# EAGLE design esp32-poe-thermocouple-hat-prod-onboard (EAGLE 7.7.0)
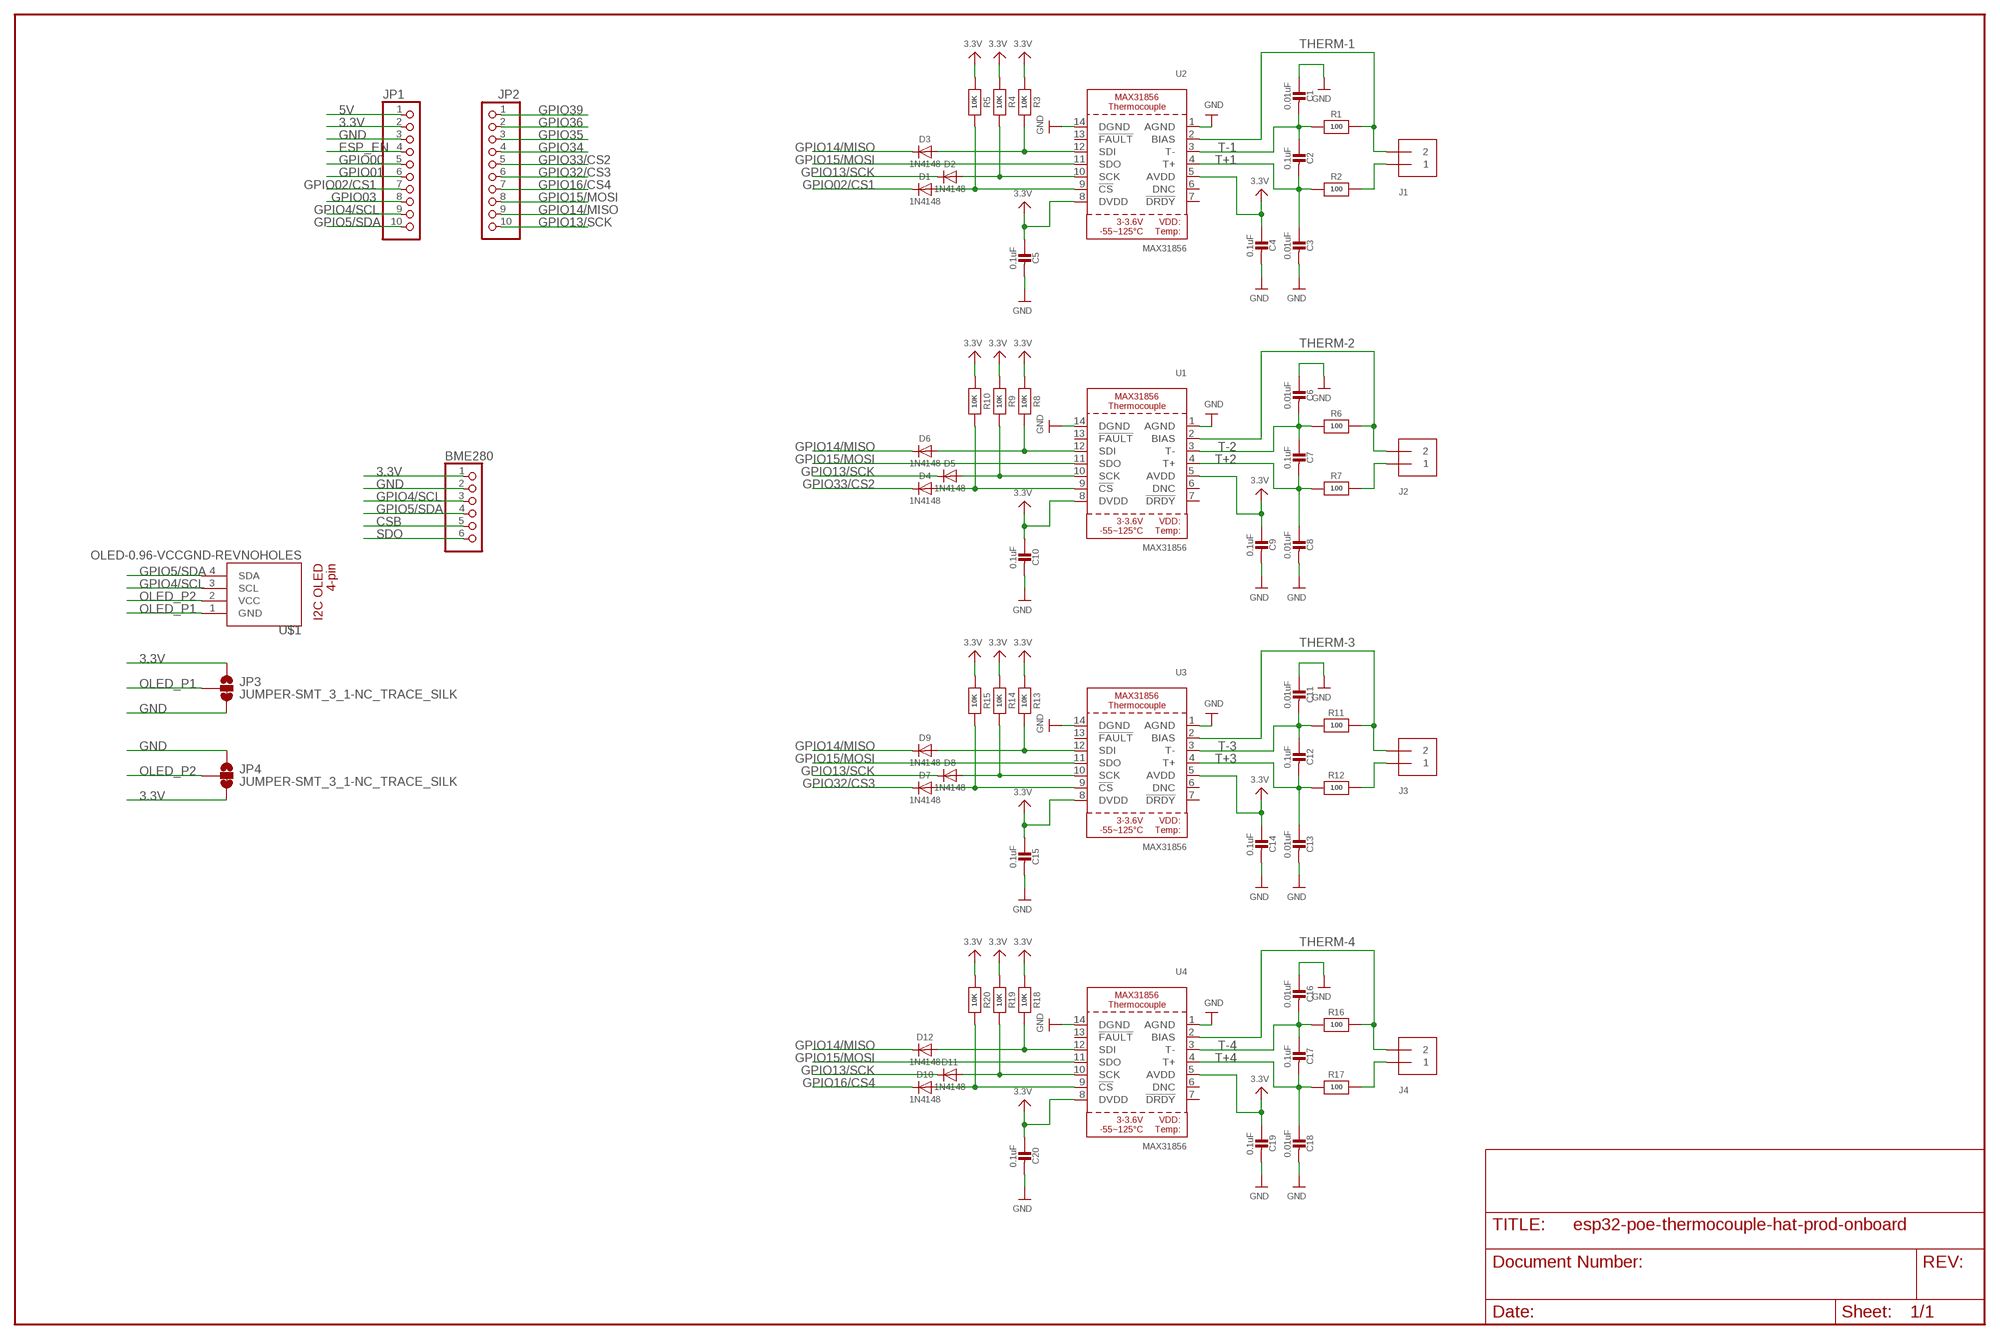
[diagram p0: schematic, sheet 1]

## Parts
BME280  PINHD-1X6  [1X06]
C1  0.01uF  CAP_CERAMIC0805_10MGAP  [0805_10MGAP]
C2  0.1uF  CAP_CERAMIC0805-NOOUTLINE  [0805-NO]
C3  0.01uF  CAP_CERAMIC0805-NOOUTLINE  [0805-NO]
C4  0.1uF  CAP_CERAMIC0805-NOOUTLINE  [0805-NO]
C5  0.1uF  CAP_CERAMIC0805-NOOUTLINE  [0805-NO]
C6  0.01uF  CAP_CERAMIC0805_10MGAP  [0805_10MGAP]
C7  0.1uF  CAP_CERAMIC0805-NOOUTLINE  [0805-NO]
C8  0.01uF  CAP_CERAMIC0805-NOOUTLINE  [0805-NO]
C9  0.1uF  CAP_CERAMIC0805-NOOUTLINE  [0805-NO]
C10  0.1uF  CAP_CERAMIC0805-NOOUTLINE  [0805-NO]
C11  0.01uF  CAP_CERAMIC0805_10MGAP  [0805_10MGAP]
C12  0.1uF  CAP_CERAMIC0805-NOOUTLINE  [0805-NO]
C13  0.01uF  CAP_CERAMIC0805-NOOUTLINE  [0805-NO]
C14  0.1uF  CAP_CERAMIC0805-NOOUTLINE  [0805-NO]
C15  0.1uF  CAP_CERAMIC0805-NOOUTLINE  [0805-NO]
C16  0.01uF  CAP_CERAMIC0805_10MGAP  [0805_10MGAP]
C17  0.1uF  CAP_CERAMIC0805-NOOUTLINE  [0805-NO]
C18  0.01uF  CAP_CERAMIC0805-NOOUTLINE  [0805-NO]
C19  0.1uF  CAP_CERAMIC0805-NOOUTLINE  [0805-NO]
C20  0.1uF  CAP_CERAMIC0805-NOOUTLINE  [0805-NO]
D1  1N4148  DIODESOD-323  [SOD-323]
D2  1N4148  DIODESOD-323  [SOD-323]
D3  1N4148  DIODESOD-323  [SOD-323]
D4  1N4148  DIODESOD-323  [SOD-323]
D5  1N4148  DIODESOD-323  [SOD-323]
D6  1N4148  DIODESOD-323  [SOD-323]
D7  1N4148  DIODESOD-323  [SOD-323]
D8  1N4148  DIODESOD-323  [SOD-323]
D9  1N4148  DIODESOD-323  [SOD-323]
D10  1N4148  DIODESOD-323  [SOD-323]
D11  1N4148  DIODESOD-323  [SOD-323]
D12  1N4148  DIODESOD-323  [SOD-323]
J1  TERMBLOCK_1X2-7.62-SCREW  [TERMBLOCK_1X2-7.62MM-SCREW]
J2  TERMBLOCK_1X2-7.62-SCREW  [TERMBLOCK_1X2-7.62MM-SCREW]
J3  TERMBLOCK_1X2-7.62-SCREW  [TERMBLOCK_1X2-7.62MM-SCREW]
J4  TERMBLOCK_1X2-7.62-SCREW  [TERMBLOCK_1X2-7.62MM-SCREW]
JP1  PINHD-1X10  [1X10]
JP2  PINHD-1X10  [1X10]
JP3  JUMPER-SMT_3_1-NC_TRACE_SILK  [SMT-JUMPER_3_1-NC_TRACE_SILK]
JP4  JUMPER-SMT_3_1-NC_TRACE_SILK  [SMT-JUMPER_3_1-NC_TRACE_SILK]
R1  100  RESISTOR0805_NOOUTLINE  [0805-NO]
R2  100  RESISTOR0805_NOOUTLINE  [0805-NO]
R3  10K  RESISTOR0805_NOOUTLINE  [0805-NO]
R4  10K  RESISTOR0805_NOOUTLINE  [0805-NO]
R5  10K  RESISTOR0805_NOOUTLINE  [0805-NO]
R6  100  RESISTOR0805_NOOUTLINE  [0805-NO]
R7  100  RESISTOR0805_NOOUTLINE  [0805-NO]
R8  10K  RESISTOR0805_NOOUTLINE  [0805-NO]
R9  10K  RESISTOR0805_NOOUTLINE  [0805-NO]
R10  10K  RESISTOR0805_NOOUTLINE  [0805-NO]
R11  100  RESISTOR0805_NOOUTLINE  [0805-NO]
R12  100  RESISTOR0805_NOOUTLINE  [0805-NO]
R13  10K  RESISTOR0805_NOOUTLINE  [0805-NO]
R14  10K  RESISTOR0805_NOOUTLINE  [0805-NO]
R15  10K  RESISTOR0805_NOOUTLINE  [0805-NO]
R16  100  RESISTOR0805_NOOUTLINE  [0805-NO]
R17  100  RESISTOR0805_NOOUTLINE  [0805-NO]
R18  10K  RESISTOR0805_NOOUTLINE  [0805-NO]
R19  10K  RESISTOR0805_NOOUTLINE  [0805-NO]
R20  10K  RESISTOR0805_NOOUTLINE  [0805-NO]
U1  MAX31856  [TSSOP14]
U2  MAX31856  [TSSOP14]
U3  MAX31856  [TSSOP14]
U4  MAX31856  [TSSOP14]
U$1  OLED-0.96-VCCGND-REVNOHOLES  [OLED-I2C-4PIN-NOHOLES]

## Nets
3.3V: BME280.1 C4.1 C5.1 C9.1 C10.1 C14.1 C15.1 C19.1 C20.1 JP1.2 JP3.1 JP4.3 R3.2 R4.2 R5.2 R8.2 R9.2 R10.2 R13.2 R14.2 R15.2 R18.2 R19.2 R20.2 U1.5(AVDD) U1.8(DVDD) U2.5(AVDD) U2.8(DVDD) U3.5(AVDD) U3.8(DVDD) U4.5(AVDD) U4.8(DVDD)
5V: JP1.1
!CS_3V: D1.A R5.1 U2.9(!CS)
!CS_3V1: D4.A R10.1 U1.9(!CS)
!CS_3V2: D7.A R15.1 U3.9(!CS)
!CS_3V3: D10.A R20.1 U4.9(!CS)
CSB: BME280.5
ESP_EN: JP1.4
GND: BME280.2 C1.1 C3.2 C4.2 C5.2 C6.1 C8.2 C9.2 C10.2 C11.1 C13.2 C14.2 C15.2 C16.1 C18.2 C19.2 C20.2 JP1.3 JP3.3 JP4.1 U1.1(AGND) U1.14(DGND) U2.1(AGND) U2.14(DGND) U3.1(AGND) U3.14(DGND) U4.1(AGND) U4.14(DGND)
GPIO00: JP1.5
GPIO01: JP1.6
GPIO02/CS1: D1.C JP1.7
GPIO03: JP1.8
GPIO4/SCL: BME280.3 JP1.9 U$1.3(SCL)
GPIO5/SDA: BME280.4 JP1.10 U$1.4(SDA)
GPIO13/SCK: D2.C D5.C D8.C D11.C JP2.10
GPIO14/MISO: D3.C D6.C D9.C D12.C JP2.9
GPIO15/MOSI: JP2.8 U1.11(SDO) U2.11(SDO) U3.11(SDO) U4.11(SDO)
GPIO16/CS4: D10.C JP2.7
GPIO32/CS3: D7.C JP2.6
GPIO33/CS2: D4.C JP2.5
GPIO34: JP2.4
GPIO35: JP2.3
GPIO36: JP2.2
GPIO39: JP2.1
OLED_P1: JP3.2 U$1.1(GND)
OLED_P2: JP4.2 U$1.2(VCC)
SCK_3V: D2.A R4.1 U2.10(SCK)
SCK_3V1: D5.A R9.1 U1.10(SCK)
SCK_3V2: D8.A R14.1 U3.10(SCK)
SCK_3V3: D11.A R19.1 U4.10(SCK)
SDO: BME280.6
SDO_3V: D3.A R3.1 U2.12(SDI)
SDO_3V1: D6.A R8.1 U1.12(SDI)
SDO_3V2: D9.A R13.1 U3.12(SDI)
SDO_3V3: D12.A R18.1 U4.12(SDI)
T+1: C2.2 C3.1 R2.2 U2.4(T+)
T+2: C7.2 C8.1 R7.2 U1.4(T+)
T+3: C12.2 C13.1 R12.2 U3.4(T+)
T+4: C17.2 C18.1 R17.2 U4.4(T+)
T-1: C1.2 C2.1 R1.2 U2.3(T-)
T-2: C6.2 C7.1 R6.2 U1.3(T-)
T-3: C11.2 C12.1 R11.2 U3.3(T-)
T-4: C16.2 C17.1 R16.2 U4.3(T-)
THERM+1: J1.1 R2.1
THERM+2: J2.1 R7.1
THERM+3: J3.1 R12.1
THERM+4: J4.1 R17.1
THERM-1: J1.2 R1.1 U2.2(BIAS)
THERM-2: J2.2 R6.1 U1.2(BIAS)
THERM-3: J3.2 R11.1 U3.2(BIAS)
THERM-4: J4.2 R16.1 U4.2(BIAS)
Unconnected: U1.6(DNC) U1.7(!DRDY) U1.13(!FAULT) U2.6(DNC) U2.7(!DRDY) U2.13(!FAULT) U3.6(DNC) U3.7(!DRDY) U3.13(!FAULT) U4.6(DNC) U4.7(!DRDY) U4.13(!FAULT)

## Library data of the parts
BME280 = pinhead:PINHD-1X6: PIN HEADER
C1-C20 = microbuilder:CAP_CERAMIC: Ceramic Capacitors For new designs, use the packages preceded by an '_' character since they are more reliable: The following footprints should be used on most boards: _0402 - Standard footprint for regular board layouts _0603 - Standard footprint for regular board layouts _0805 - Standard footprint for regular board layouts _1206 - Standard footprint for regular board layouts For extremely tight-pitch boards where space is at a premium, the following 'micro-pitch' footprints can be used (smaller pads, no silkscreen outline, etc.): _0402MP - Micro-pitch footprint for very dense/compact boards _0603MP - Micro-pitch footprint for very dense/compact boards _0805MP - Micro-pitch footprint for very dense/compact boards _1206MP - Micro-pitch footprint for very dense/compact boards
D1-D12 = microbuilder:DIODE: Diode SMA Model Volts Amps Type Vf Ir Digikey # Notes SSA34-E3 40V 3A Schottky 480mV @ 3A 200uA @ 40V SSA34-E3/61TGITR-ND CDBA120-G 20V 1A Schottky 500mV @ 1A 500uA @ 20V 641-1014-6-ND REEL MBRA210 10V 2A Schottky 350mV @ 2A 700uA @ 10V MBRA210LT3 SOD-123 Model Volts Amps Type Vf Ir Order # Notes BAT54T1G 30V 200mA Schottky 800mV @ 200mA 2uA @ 25V BAT54T1GOSTR-ND B0530W 30V 500mA Schottky 430mV @ 500mA 130uA @ 30V B0530W-FDICT-ND REEL MBR120 20V 1A Schottky 340mV @ 1A MBR120VLSFT1GOSCT-ND SOD-323 Model Volts Amps Type Vf Ir Order # Notes PMEG2005EJ 20V 500mA Schottky 355mV @ 500mA 568-4110-1-ND ZLLS410 10V 570mA Schottky 380mV @ 570mA ZLLS410CT-ND 1N4148WS 75V 150mA Silicon/Simple 1V 1N4148WSFSCT-ND REEL SOD-523 Model Volts Amps Type Vf Ir Order # Notes BAT54XV2 30V 200mA Schottky 0.8V @ 100mA BAT54XV2CT-ND TB751S 30V 30mA Schottky RB751S-40TE61CT-ND SOT23-R/W (R = Solder Paste/Reflow Ovens, W = Hand-Soldering) Model Volts Amps Type Vf Ir Order # Notes BAT54FILM 40V 300mA Schottky 497-7162-1-ND POWERDI-5 Model Volts Amps Type Vf Ir Order # Notes PDS560 60V 5A Schottky 670mV @ 5A 150uA @ 60V PDS560DICT-ND
J1-J4 = Connectors:TERMBLOCK_1X2-7.62-SCREW: 3.5mm Terminal block http://www.ladyada.net/library/pcb/eaglelibrary.html
JP1 JP2 = pinhead:PINHD-1X10: PIN HEADER
JP3 JP4 = SparkFun-Jumpers:JUMPER-SMT_3_1-NC_TRACE: Normally closed trace jumper (1 of 2 connections) This jumper has a trace between two pads so it's normally closed (NC). The other connection is normally open (NO). Use a razor knife to open the connection. For best results follow the IPC guidelines for cutting traces: Cutout at least 0.063 mm (0.005 in). Remove all loose material to clean up the cut area. Seal the cut with an approved epoxy. Reapply solder to reclose the connection, or to close the NO connection.
R1-R20 = microbuilder:RESISTOR: Resistors For new designs, use the packages preceded by an '_' character since they are more reliable: The following footprints should be used on most boards: _0402 - Standard footprint for regular board layouts _0603 - Standard footprint for regular board layouts _0805 - Standard footprint for regular board layouts _1206 - Standard footprint for regular board layouts For extremely tight-pitch boards where space is at a premium, the following 'micro-pitch' footprints can be used (smaller pads, no silkscreen outline, etc.): _0402MP - Micro-pitch footprint for very dense/compact boards _0603MP - Micro-pitch footprint for very dense/compact boards _0805MP - Micro-pitch footprint for very dense/compact boards _1206MP - Micro-pitch footprint for very dense/compact boards
U1-U4 = microbuilder:MAX31856: MAX31856 - Thermocouple Sensor ADC
U$1 = Warthog9-Screens:OLED-0.96-VCCGND-REV: Common 0.96 OLED screen assembly

## Board
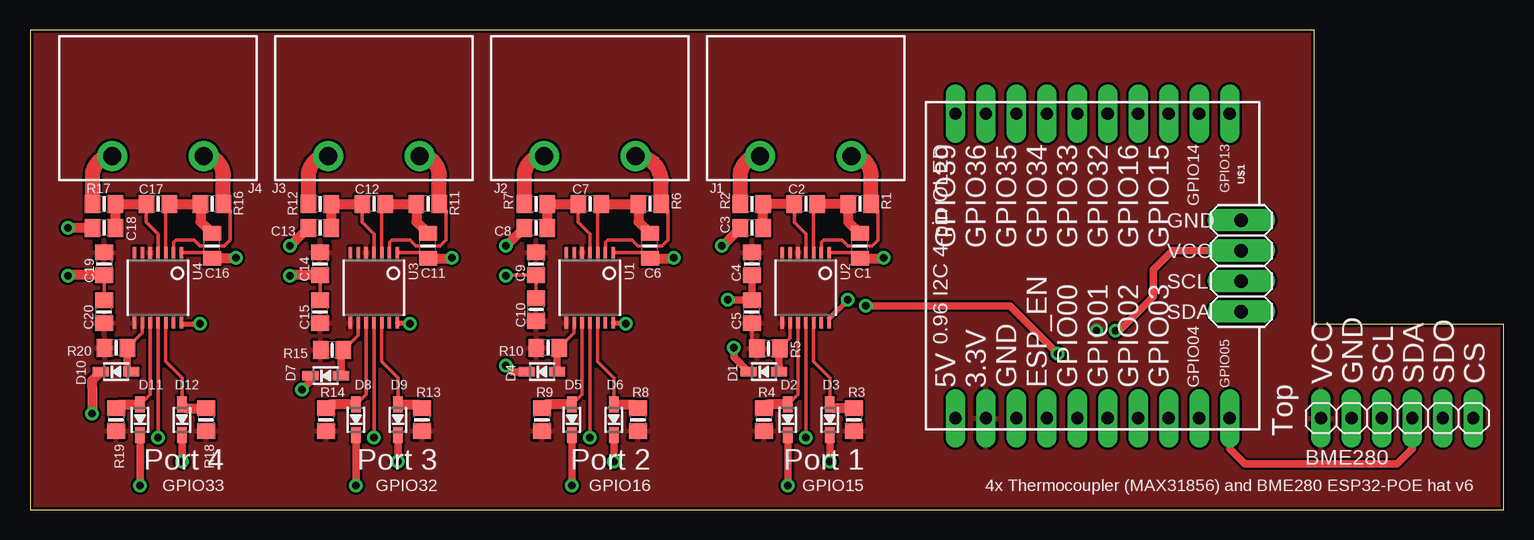
[diagram p1: board, top side]
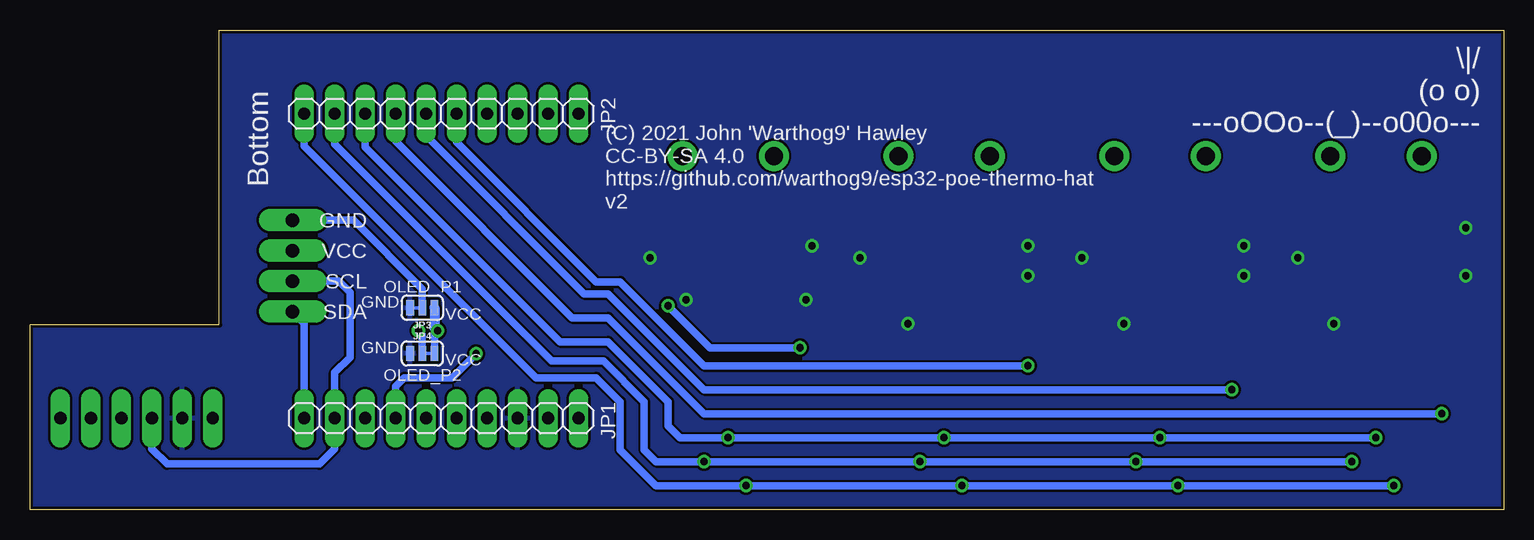
[diagram p2: board, bottom side, seen from below]

Size 122.86 x 40 mm. Coordinates in mm from the lower left corner, seen from the top.
Outline: 122.86,0 122.86,15.43 107.08,15.43 107.08,40 0,40 0,0 122.86,0
Copper layers (1*16): Top 0.035mm / dielectric 1.5mm / Bottom 0.035mm
Design rules "SparkFun *": minimum track width 8mil, minimum drill 20mil, track to track 8mil, track to pad 8mil, pad to pad 8mil, via to via 8mil, smd to smd 8mil, copper to edge 10mil, drill to drill 8mil, minimum pad ring 12mil, minimum via ring 10mil, stop-mask expansion 4mil, vias tented up to drill 25mil, thermal gap 10mil

### Footprints (pad centres in the part's own frame; a part is rotated, then mirrored left to right if it is on the bottom)
1X06 = drill 1.016 long: 1 -6.35,0; 2 -3.81,0; 3 -1.27,0; 4 1.27,0; 5 3.81,0; 6 6.35,0
0805_10MGAP = smd 1.2 x 1.5: 1 -1.05,0; 2 1.05,0
0805-NO = smd 1.3 x 1.5: 1 -0.95,0; 2 0.95,0
SOD-323 = smd 1.35 x 0.8: A 1.27,0; C -1.27,0
TERMBLOCK_1X2-7.62MM-SCREW = drill 1.5 pad 2.5: 1 3.81,0; 2 -3.81,0
1X10 = drill 1.016 long: 1 -11.43,0; 2 -8.89,0; 3 -6.35,0; 4 -3.81,0; 5 -1.27,0; 6 1.27,0; 7 3.81,0; 8 6.35,0; 9 8.89,0; 10 11.43,0
SMT-JUMPER_3_1-NC_TRACE_SILK = smd 0.635 x 1.27: 1 -1.016,0; 2 0,0; 3 1.016,0
TSSOP14 = smd 0.305 x 0.991: 1 -1.95,-2.918; 2 -1.3,-2.918; 3 -0.65,-2.918; 4 0,-2.918; 5 0.65,-2.918; 6 1.3,-2.918; 7 1.95,-2.918; 8 1.95,2.918; 9 1.3,2.918; 10 0.65,2.918; 11 0,2.918; 12 -0.65,2.918; 13 -1.3,2.918; 14 -1.95,2.918
OLED-I2C-4PIN-NOHOLES = drill 1.118 pad 1.88 long: 1 -3.81,12.4; 2 -1.27,12.4; 3 1.27,12.4; 4 3.81,12.4

### Placement (x,y rotation side)
BME280  113.97,7.62 0 top
C1  69.17,22 90 top
C2  64.67,25.5 180 top
C3  60.17,23.5 180 top
C4  60.17,20.5 270 top
C5  60.17,16.5 90 top
C6  51.67,22 90 top
C7  46.67,25.5 180 top
C8  42.17,23.5 180 top
C9  42.17,20.5 270 top
C10  42.19,16.68 90 top
C11  33.17,22 90 top
C12  28.67,25.5 180 top
C13  24.17,23.5 180 top
C14  24.17,20.5 270 top
C15  24.17,16.5 90 top
C16  15.17,22 90 top
C17  10.67,25.5 180 top
C18  6.17,23.5 180 top
C19  6.17,20.5 270 top
C20  6.17,16.5 90 top
D1  61.17,11.5 0 top
D2  63.17,7.5 90 top
D3  66.67,7.5 90 top
D4  42.67,11.5 0 top
D5  45.17,7.5 90 top
D6  48.67,7.5 90 top
D7  24.65,11.16 0 top
D8  27.17,7.5 90 top
D9  30.67,7.5 90 top
D10  7.17,11.5 0 top
D11  9.17,7.5 90 top
D12  12.67,7.5 90 top
J1  64.67,29.5 180 top
J2  46.67,29.5 180 top
J3  28.67,29.5 180 top
J4  10.67,29.5 180 top
JP1  88.57,7.62 180 bottom
JP2  88.57,33.02 180 bottom
JP3  90.16,16.83 180 bottom
JP4  90.16,13.02 0 bottom
R1  69.17,25.5 180 top
R2  60.17,25.5 0 top
R3  68.67,7.5 270 top
R4  61.17,7.5 270 top
R5  61.55,13.44 180 top
R6  51.67,25.5 180 top
R7  42.17,25.5 0 top
R8  50.67,7.5 270 top
R9  42.67,7.5 270 top
R10  43.17,13.5 180 top
R11  33.17,25.5 180 top
R12  24.17,25.5 0 top
R13  32.67,7.5 270 top
R14  24.67,7.5 270 top
R15  25.19,13.3 180 top
R16  15.17,25.5 180 top
R17  6.17,25.5 0 top
R18  14.67,7.5 270 top
R19  7.17,7.5 270 top
R20  7.17,13.5 180 top
U1  46.67,18.5 180 top
U2  64.67,18.5 180 top
U3  28.67,18.5 180 top
U4  10.67,18.5 180 top
U$1  88.57,20.32 270 top

### Tracks (layer width: path | path; a pad name or v marks a point on that pad's centre or on a via)
3.3V  (via drill 0.6)
  Top 0.305: R5.2 60.17,13.87 C5.1
  Bottom 0.61: JP4.3 89.14,14.67 v88.89,14.92
  Bottom 0.813: JP3.1 89.14,15.18 v88.89,14.92
  pour Top: -1.6,44.45 -1.6,-5.08 125.4,-5.08 125.4,44.45
!CS_3V
  Top 0.305: U2.9 63.37,14.31 R5.1 62.44,13.38
  Top 0.61: D1.A 62.44,13.38
!CS_3V1
  Top 0.305: U1.9 45.37,14.75 R10.1 43.94,13.32
  Top 0.61: D4.A 43.94,13.32
!CS_3V2
  Top 0.305: U3.9 27.37,14.53 R15.1 25.92,13.08
  Top 0.61: 25.92,13.08 D7.A
!CS_3V3
  Top 0.305: U4.9 9.37,14.75 R20.1 | D10.A 8.12,11.32
  Top 0.61: 8.12,11.32 R20.1
GND  (via drill 0.6)
  Top 0.305: U2.1 68.7,21.42 C1.1 | 71.12,20.95 v71.17,21 | U2.14 66.62,15.95 | C10.2 42.17,17.65 C9.2 39.72,19.55 v39.67,19.5 | C8.2 41.17,23.5 | 49.59,15.58 v49.67,15.5 | 53.62,20.95 v53.67,21 | U1.1 51.2,21.42 C6.1 | 31.59,15.58 arc-90 v31.67,15.5 | C14.2 C15.2 | 21.72,19.55 arc90 v21.67,19.5 | U3.1 32.7,21.42 arc-90 C11.1 | 35.12,20.95 v35.17,21 | C13.2 23.17,23.5 | U4.14 12.7,15.5 | C16.1 15.22,21 15.67,21 arc90 15.25,21.42 U4.1 | C19.2 C20.2
  Top 0.406: 66.62,15.95 v68.17,17.5 | U1.14 49.59,15.58 | U3.14 31.59,15.58 | 12.7,15.5 v14.17,15.5
  Top 0.61: v58.17,17.5 60.12,17.5 C5.2 C4.2 | 57.72,22 v57.67,22 | 3.22,19.55 v3.17,19.5
  Top 0.813: C3.2 57.72,22 | C1.1 71.12,20.95 | 41.17,23.5 v39.67,22 | C6.1 53.62,20.95 | C14.2 21.72,19.55 | C11.1 35.12,20.95 | 23.17,23.5 v21.67,22 | 15.67,21 v17.17,21 | C18.2 v3.17,23.5 | C19.2 3.22,19.55
  pour Bottom: -4.14,-7.62 -4.14,46.99 127.94,46.99 127.94,-7.62
GPIO02/CS1  (via drill 0.6)
  Top 0.61: v85.67,13 81.67,17 v69.67,17 | D1.C 58.67,12.73 v58.67,13.5
  Bottom 0.61: JP1.7 92.38,10.29 91.67,11 87.67,11 v85.67,13 | v69.67,17 66.17,13.5 v58.67,13.5
GPIO4/SCL
  Bottom 0.61: BME280.3 112.7,5.08 111.43,3.81 98.73,3.81 97.46,5.08 JP1.9 97.46,11.43 96.19,12.7 96.19,18.1 97.14,19.05 U$1.3
GPIO5/SDA
  Top 0.61: JP1.10 100,5.08 101.27,3.81 113.97,3.81 115.24,5.08 BME280.4
  Bottom 0.61: JP1.10 100,15.54 U$1.4
GPIO13/SCK  (via drill 0.6)
  Top 0.61: D2.C v63.17,2 | D5.C v45.17,2 | D8.C v27.17,2 | D11.C v9.17,2
  Bottom 0.61: JP2.10 100,30.48 100,30.33 80.67,11 75.67,11 73.67,9 73.67,5 70.67,2 v63.17,2 v45.17,2 v27.17,2 v9.17,2
GPIO14/MISO  (via drill 0.6)
  Top 0.61: D3.C v66.67,4 | D6.C v48.67,4 | D9.C v30.67,4 | D12.C v12.67,4
  Bottom 0.61: JP2.9 97.46,30.48 79.36,12.38 75.05,12.38 71.67,9 71.67,5 70.67,4 v66.67,4 v48.67,4 v30.67,4 v12.67,4
GPIO15/MOSI  (via drill 0.6)
  Top 0.305: U2.11 v64.67,6 | U1.11 v46.67,6 | U3.11 v28.67,6 | U4.11 v10.67,6
  Bottom 0.61: JP2.8 94.92,30.25 78.67,14 74.67,14 69.67,9 69.67,7 68.67,6 v64.67,6 v46.67,6 v28.67,6 v10.67,6
GPIO16/CS4  (via drill 0.6)
  Top 0.813: v5.17,8 5.17,10.27 5.17,10.77 D10.C
  Bottom 0.61: JP2.7 92.38,30.71 77.67,16 74.67,16 66.67,8 v5.17,8
GPIO32/CS3  (via drill 0.6)
  Top 0.305: D7.C 23.38,10.71
  Top 0.61: 23.38,10.71 v22.67,10
  Bottom 0.61: JP2.6 89.84,31.17 76.67,18 74.67,18 66.67,10 v22.67,10
GPIO33/CS2  (via drill 0.6)
  Top 0.61: D4.C 40.17,11.5 v39.67,12
  Bottom 0.61: JP2.5 87.3,30.63 75.67,19 73.67,19 66.67,12 v39.67,12
OLED_P1
  Bottom 0.61: U$1.1 95.87,24.13 90.16,18.41 JP3.2
OLED_P2  (via drill 0.6)
  Top 0.61: U$1.2 95.24,21.59 93.65,20 93.65,17.78 90.79,14.92 v90.48,14.92
  Bottom 0.61: JP4.2 90.16,14.61 v90.48,14.92
SCK_3V
  Top 0.305: U2.10 64.02,9.62 D2.A | 61.49,8.77 R4.1
  Top 0.813: D2.A 61.49,8.77
SCK_3V1
  Top 0.305: U1.10 46.02,9.62 D5.A | 42.99,8.77 R9.1
  Top 0.813: D5.A 42.99,8.77
SCK_3V2
  Top 0.305: U3.10 28.02,9.62 D8.A | 24.99,8.77 R14.1
  Top 0.813: D8.A 24.99,8.77
SCK_3V3
  Top 0.305: U4.10 10.02,9.62 D11.A | R19.1 7.49,8.77
  Top 0.813: 7.49,8.77 D11.A
SDO_3V
  Top 0.305: 66.99,8.45 D3.A 66.67,11 65.32,12.35 U2.12
  Top 0.813: R3.1 66.99,8.45
SDO_3V1
  Top 0.305: 50.35,8.77 R8.1 | U1.12 47.32,12.35 48.67,11 D6.A
  Top 0.813: D6.A 50.35,8.77
SDO_3V2
  Top 0.305: U3.12 29.32,12.35 30.67,11 D9.A | 32.35,8.77 R13.1
  Top 0.813: D9.A 32.35,8.77
SDO_3V3
  Top 0.305: U4.12 11.32,12.35 12.67,11 D12.A 12.99,8.45
  Top 0.813: 12.99,8.45 R18.1
T+1
  Top 0.305: U2.4 64.67,23 63.72,23.95 C2.2
  Top 0.813: C2.2 R2.2 C3.1
T+2
  Top 0.305: U1.4 46.67,23 45.67,24 45.67,25.45 C7.2 | 43.17,25.45 R7.2
  Top 0.813: 45.67,25.45 43.17,25.45 | R7.2 C8.1
T+3
  Top 0.305: U3.4 28.67,23 27.67,24 27.67,25.45 C12.2 | 25.17,25.45 R12.2
  Top 0.813: 27.67,25.45 25.17,25.45 | R12.2 C13.1
T+4
  Top 0.305: U4.4 10.67,23 9.67,24 9.67,25.45 C17.2
  Top 0.813: C17.2 R17.2 C18.1
T-1
  Top 0.305: 68.12,25.4 R1.2 | U2.3 65.32,25.3 C2.1
  Top 0.813: C2.1 R1.2 68.22,24 C1.2
T-2
  Top 0.305: U1.3 47.32,25.2 C7.1
  Top 0.813: C7.1 R6.2 50.72,24 C6.2
T-3
  Top 0.305: U3.3 29.32,25.2 C12.1
  Top 0.813: C12.1 R11.2 32.22,24 C11.2
T-4
  Top 0.305: U4.3 11.32,25.2 C17.1
  Top 0.813: C17.1 R16.2 14.22,24 C16.2
THERM+1
  Top 1.27: R2.1 59.22,27.86 arc-90 J1.1
THERM+2
  Top 1.27: R7.1 41.22,27.86 arc-90 J2.1
THERM+3
  Top 1.27: R12.1 23.22,27.86 arc-90 J3.1
THERM+4
  Top 1.27: R17.1 5.22,27.86 arc-90 J4.1
THERM-1
  Top 0.305: U2.2 65.97,22.3 66.17,22.5 67.67,22.5 68.17,22 70.17,22 70.67,22.5 70.67,24.95 R1.1
  Top 1.27: R1.1 70.12,27.86 arc90 J1.2
THERM-2
  Top 0.305: U1.2 47.97,22.3 48.17,22.5 50.17,22.5 50.67,22 52.67,22 53.17,22.5 53.17,24.95 R6.1
  Top 1.27: R6.1 52.62,27.36 arc90 J2.2
THERM-3
  Top 0.305: U3.2 29.97,22.3 30.17,22.5 31.67,22.5 32.17,22 34.17,22 34.67,22.5 34.67,24.95 R11.1
  Top 1.27: R11.1 34.12,27.86 arc90 J3.2
THERM-4
  Top 0.305: U4.2 11.97,22.3 12.17,22.5 13.67,22.5 14.17,22 16.17,22 16.67,22.5 16.67,24.95 R16.1
  Top 1.27: R16.1 16.12,27.86 arc90 J4.2

### Text on the board
tPlace: GPIO39 | GPIO36 | GPIO35 | GPIO34 | GPIO33 | GPIO32 | GPIO16 | GPIO15 | GPIO14 | GPIO13 | 5V | 3.3V | GND | ESP_EN | GPIO00 | GPIO01 | GPIO02 | GPIO03 | GPIO04 | GPIO05 | Top | VCC | GND | SCL | SDA | SDO | CS | Port 4 | Port 3 | Port 2 | Port 1 | GPIO33 | GPIO32 | GPIO16 | GPIO15 | 4x Thermocoupler (MAX31856) and BME280 ESP32-POE hat v6
bPlace: \\|/ / (o o) / ---oOOo--(_)--o00o--- | Bottom | (C) 2021 John 'Warthog9' Hawley / CC-BY-SA 4.0 / https://github.com/warthog9/esp32-poe-thermo-hat / v2 | OLED_P1 | VCC | GND | VCC | GND | OLED_P2
tStop: ::/-1 - Invalid.Network